# EAGLE schematic コントローラtwelite (EAGLE 9.6.2)
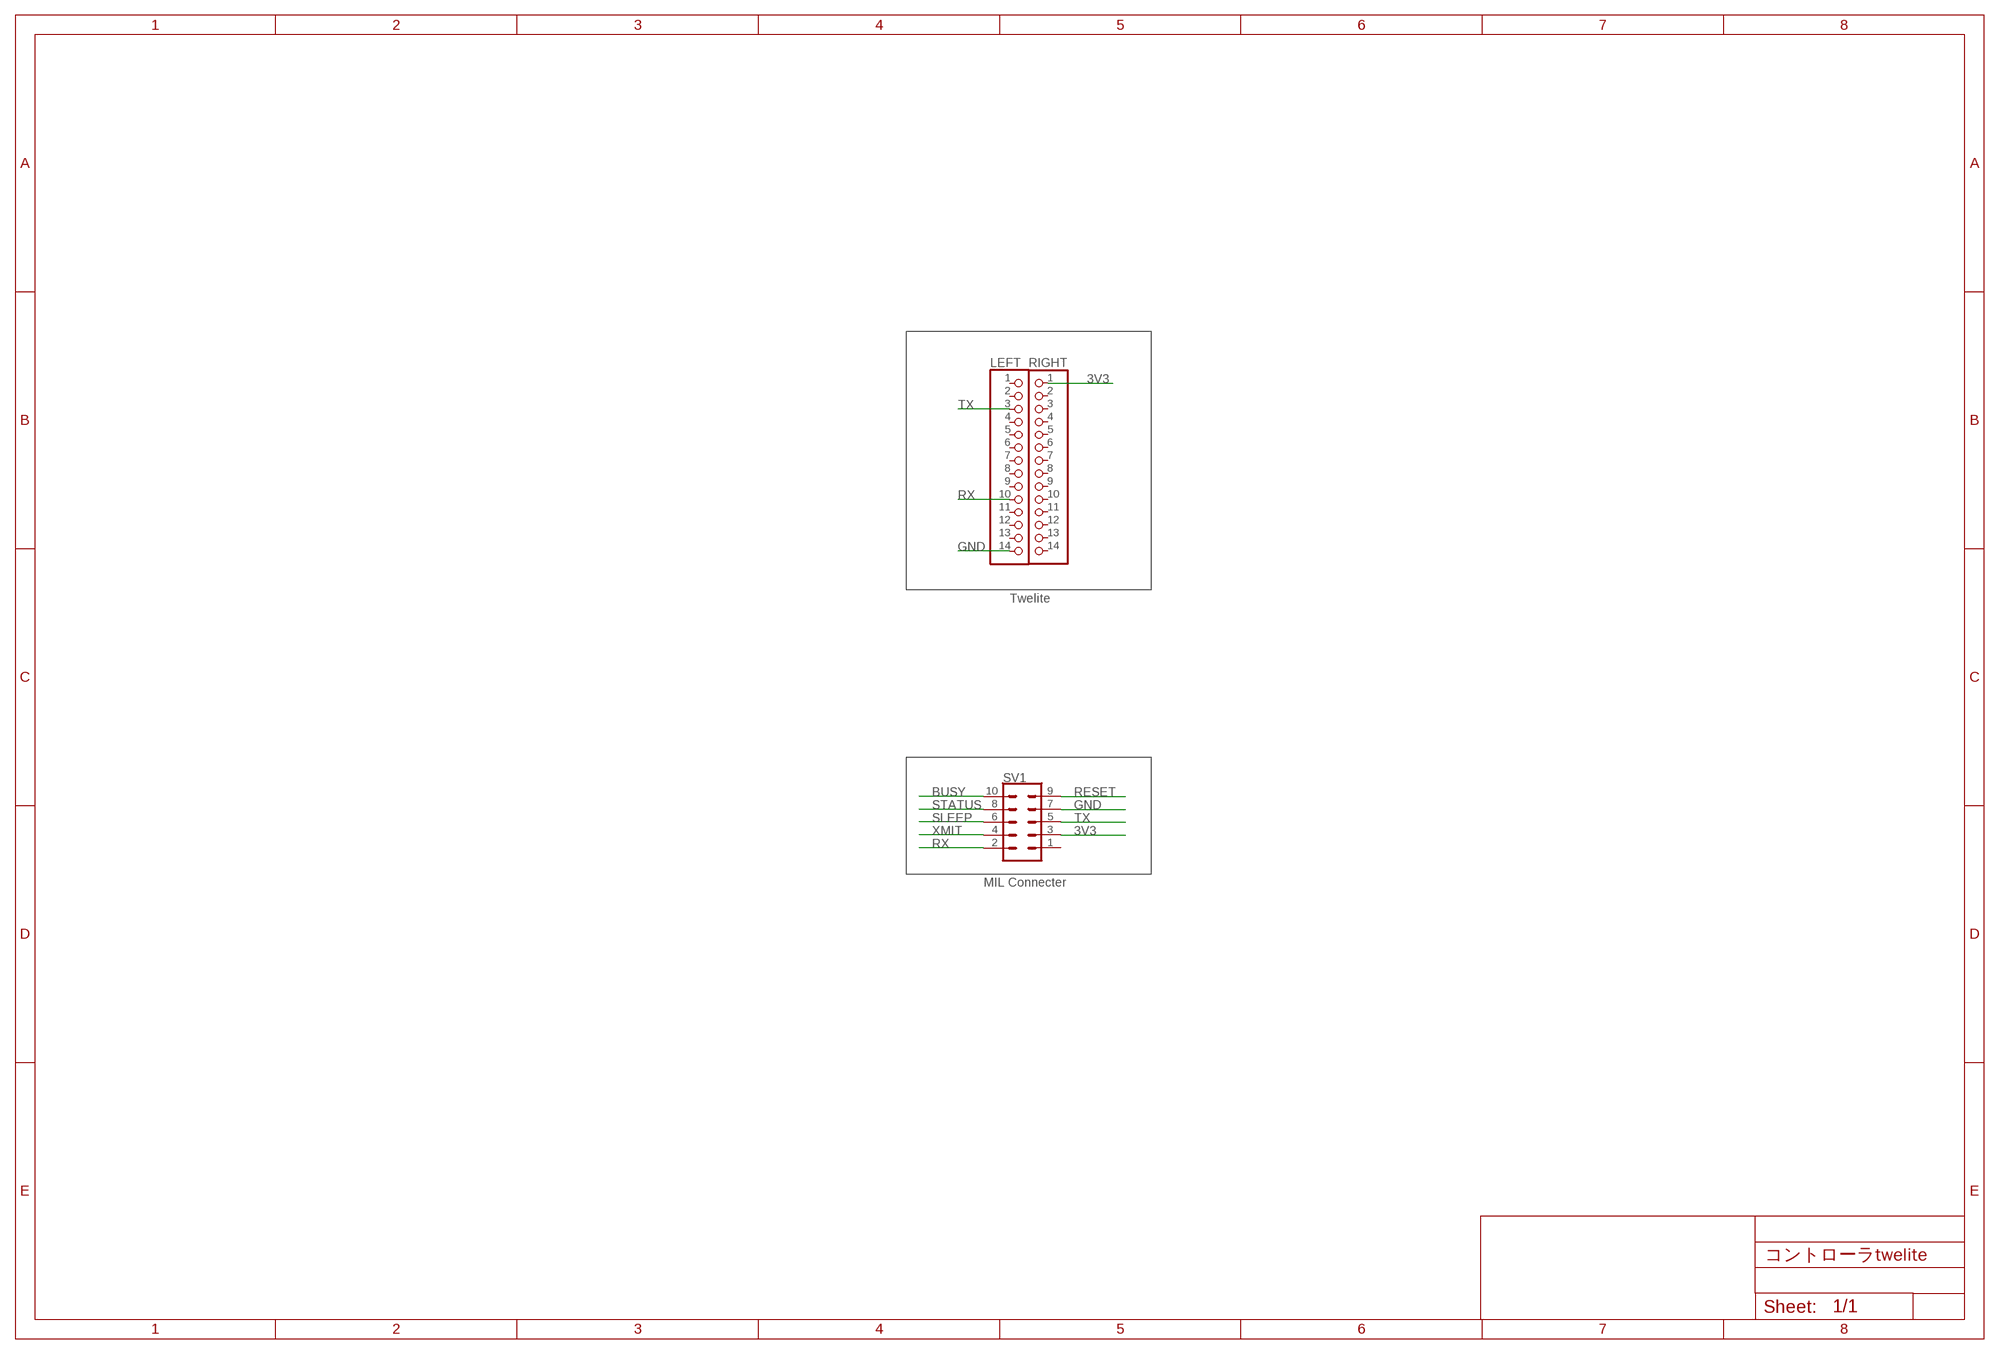
[diagram p0: schematic, sheet 1]

## Parts
LEFT  PINHD-1X14  [1X14]
RIGHT  PINHD-1X14  [1X14]
SV1  ML10  [ML10]

## Nets
3V3: RIGHT.1 SV1.3
BUSY: SV1.10
GND: LEFT.14 SV1.7
RESET: SV1.9
RX: LEFT.10 SV1.2
SLEEP: SV1.6
STATUS: SV1.8
TX: LEFT.3 SV1.5
XMIT: SV1.4
Unconnected: LEFT.1 LEFT.2 LEFT.4 LEFT.5 LEFT.6 LEFT.7 LEFT.8 LEFT.9 LEFT.11 LEFT.12 LEFT.13 RIGHT.2 RIGHT.3 RIGHT.4 RIGHT.5 RIGHT.6 RIGHT.7 RIGHT.8 RIGHT.9 RIGHT.10 RIGHT.11 RIGHT.12 RIGHT.13 RIGHT.14 SV1.1

## Notes on the sheet
- Twelite
- MIL Connecter

## Library data of the parts
LEFT RIGHT = pinhead:PINHD-1X14: PIN HEADER
SV1 = con-ml:ML10: HARTING; OC_FARNELL: unknown; OC_NEWARK: unknown